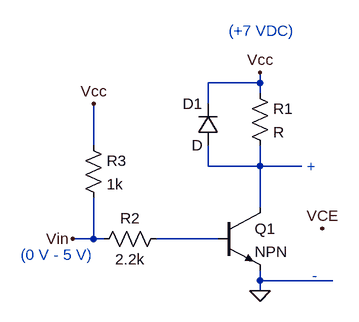
[diagram p0: schematic BJT_Driver_Schematic.asc]
BJT_Driver_Schematic.asc, the LTspice schematic file:
Version 4
SHEET 1 880 680
WIRE 192 -80 192 -96
WIRE 192 -80 112 -80
WIRE 192 -64 192 -80
WIRE 112 -48 112 -80
WIRE -64 16 -64 -48
WIRE 112 48 112 16
WIRE 192 48 192 16
WIRE 192 48 112 48
WIRE 256 48 192 48
WIRE 192 112 192 48
WIRE -64 160 -64 96
WIRE -64 160 -96 160
WIRE -48 160 -64 160
WIRE 128 160 32 160
WIRE 192 224 192 208
WIRE 304 224 192 224
WIRE 192 240 192 224
FLAG 192 240 0
FLAG 192 -96 Vcc
FLAG -96 160 Vin
FLAG -64 -48 Vcc
FLAG 288 144 VCE
SYMBOL npn 128 112 R0
SYMATTR InstName Q1
SYMBOL res 176 -80 R0
SYMATTR InstName R1
SYMBOL res 48 144 R90
WINDOW 0 0 56 VBottom 2
WINDOW 3 32 56 VTop 2
SYMATTR InstName R2
SYMATTR Value 2.2k
SYMBOL res -80 0 R0
SYMATTR InstName R3
SYMATTR Value 1k
SYMBOL diode 128 16 R180
WINDOW 0 24 64 Left 2
WINDOW 3 24 0 Left 2
SYMATTR InstName D1
TEXT 264 48 Left 2 ;+
TEXT 272 216 Left 2 ;-
TEXT -176 184 Left 2 ;(0 V - 5 V)
TEXT 144 -160 Left 2 ;(+7 VDC)

The netlist it stands for:
* BJT_Driver_Schematic.asc
Q1 N001 N002 0 0 NPN
R1 Vcc N001 R
R2 N002 Vin 2.2k
R3 Vcc Vin 1k
D1 N001 Vcc D
.model D D
.lib standard.dio
.model NPN NPN
.model PNP PNP
.lib standard.bjt
* +
* -
* (0 V - 5 V)
* (+7 VDC)
.backanno
.end